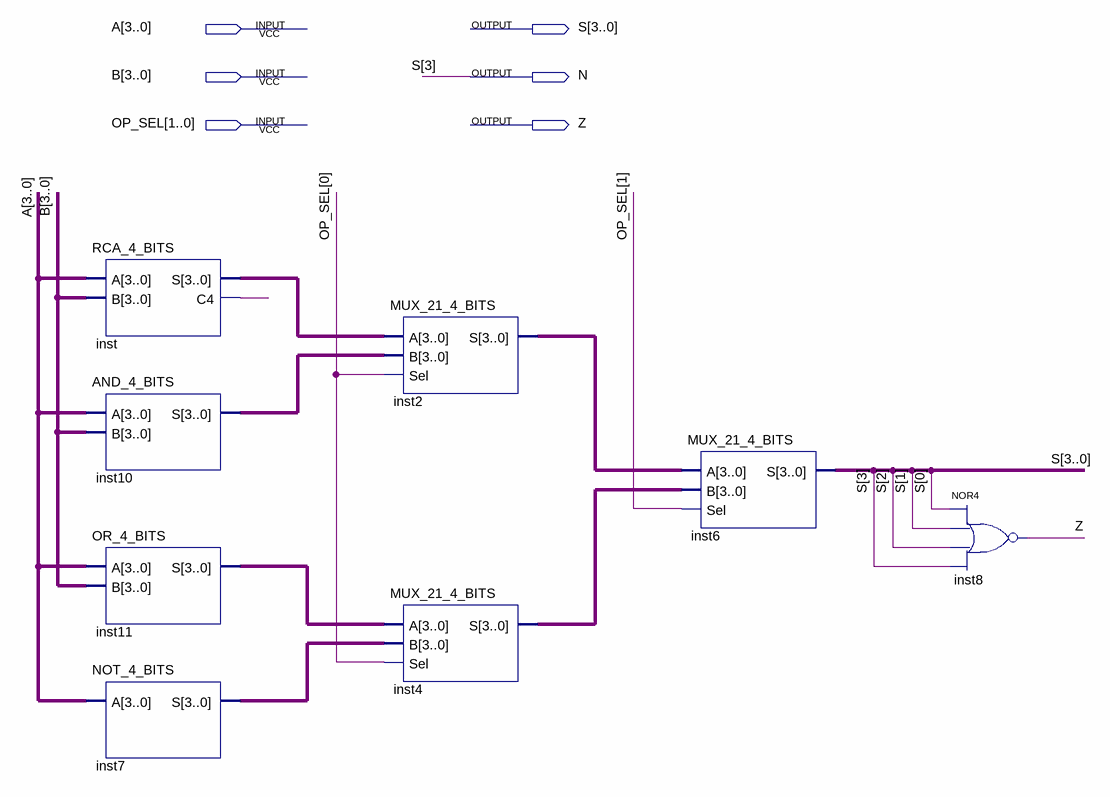
[diagram p0: schematic sheet]
// Quartus schematic ULA.bdf as structural Verilog: 8 symbols, 6 pins
module ULA (
  input  [3:0] A,
  input  [3:0] B,
  input  [1:0] OP_SEL,
  output [3:0] S,
  output N,
  output Z
);

  wire inst_c4;
  wire [3:0] inst2_s, inst4_s, inst7_s, inst10_s, inst11_s, inst_s;

  RCA_4_BITS inst (.A(A), .B(B), .S(inst_s), .C4(inst_c4));
  AND_4_BITS inst10 (.A(A), .B(B), .S(inst10_s));
  OR_4_BITS inst11 (.A(A), .B(B), .S(inst11_s));
  NOT_4_BITS inst7 (.A(A), .S(inst7_s));
  MUX_21_4_BITS inst2 (.A(inst_s), .B(inst10_s), .Sel(OP_SEL[0]), .S(inst2_s));
  MUX_21_4_BITS inst4 (.A(inst11_s), .B(inst7_s), .Sel(OP_SEL[0]), .S(inst4_s));
  MUX_21_4_BITS inst6 (.A(inst2_s), .B(inst4_s), .Sel(OP_SEL[1]), .S({N, S[2:0]}));
  nor inst8 (Z, S[0], S[1], S[2], N);

  assign S[3] = N;
endmodule
